# EAGLE design SevenSegmentBreakout (EAGLE 6.5.0)
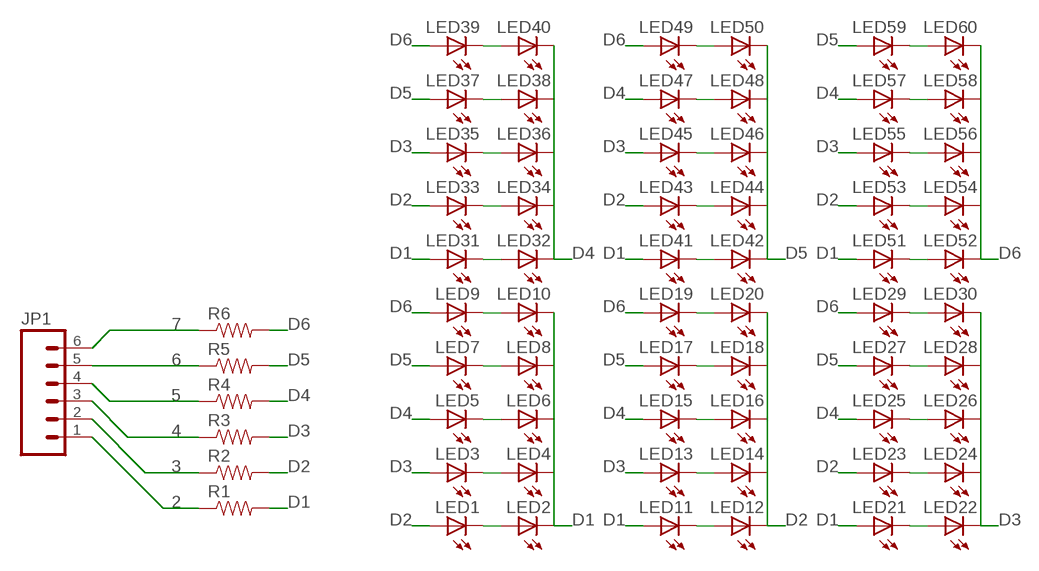
[diagram p0: schematic, sheet 1]

## Parts
JP1  M06SIP  [1X06]
LED1  LEDRECT  [RECTANGLE_LED]
LED2  LEDRECT  [RECTANGLE_LED]
LED3  LEDRECT  [RECTANGLE_LED]
LED4  LEDRECT  [RECTANGLE_LED]
LED5  LEDRECT  [RECTANGLE_LED]
LED6  LEDRECT  [RECTANGLE_LED]
LED7  LEDRECT  [RECTANGLE_LED]
LED8  LEDRECT  [RECTANGLE_LED]
LED9  LEDRECT  [RECTANGLE_LED]
LED10  LEDRECT  [RECTANGLE_LED]
LED11  LEDRECT  [RECTANGLE_LED]
LED12  LEDRECT  [RECTANGLE_LED]
LED13  LEDRECT  [RECTANGLE_LED]
LED14  LEDRECT  [RECTANGLE_LED]
LED15  LEDRECT  [RECTANGLE_LED]
LED16  LEDRECT  [RECTANGLE_LED]
LED17  LEDRECT  [RECTANGLE_LED]
LED18  LEDRECT  [RECTANGLE_LED]
LED19  LEDRECT  [RECTANGLE_LED]
LED20  LEDRECT  [RECTANGLE_LED]
LED21  LEDRECT  [RECTANGLE_LED]
LED22  LEDRECT  [RECTANGLE_LED]
LED23  LEDRECT  [RECTANGLE_LED]
LED24  LEDRECT  [RECTANGLE_LED]
LED25  LEDRECT  [RECTANGLE_LED]
LED26  LEDRECT  [RECTANGLE_LED]
LED27  LEDRECT  [RECTANGLE_LED]
LED28  LEDRECT  [RECTANGLE_LED]
LED29  LEDRECT  [RECTANGLE_LED]
LED30  LEDRECT  [RECTANGLE_LED]
LED31  LEDRECT  [RECTANGLE_LED]
LED32  LEDRECT  [RECTANGLE_LED]
LED33  LEDRECT  [RECTANGLE_LED]
LED34  LEDRECT  [RECTANGLE_LED]
LED35  LEDRECT  [RECTANGLE_LED]
LED36  LEDRECT  [RECTANGLE_LED]
LED37  LEDRECT  [RECTANGLE_LED]
LED38  LEDRECT  [RECTANGLE_LED]
LED39  LEDRECT  [RECTANGLE_LED]
LED40  LEDRECT  [RECTANGLE_LED]
LED41  LEDRECT  [RECTANGLE_LED]
LED42  LEDRECT  [RECTANGLE_LED]
LED43  LEDRECT  [RECTANGLE_LED]
LED44  LEDRECT  [RECTANGLE_LED]
LED45  LEDRECT  [RECTANGLE_LED]
LED46  LEDRECT  [RECTANGLE_LED]
LED47  LEDRECT  [RECTANGLE_LED]
LED48  LEDRECT  [RECTANGLE_LED]
LED49  LEDRECT  [RECTANGLE_LED]
LED50  LEDRECT  [RECTANGLE_LED]
LED51  LEDRECT  [RECTANGLE_LED]
LED52  LEDRECT  [RECTANGLE_LED]
LED53  LEDRECT  [RECTANGLE_LED]
LED54  LEDRECT  [RECTANGLE_LED]
LED55  LEDRECT  [RECTANGLE_LED]
LED56  LEDRECT  [RECTANGLE_LED]
LED57  LEDOVAL  [LED-OVAL]
LED58  LEDOVAL  [LED-OVAL]
LED59  LEDOVAL  [LED-OVAL]
LED60  LEDOVAL  [LED-OVAL]
R1  RESISTORAXIAL-0.3  [AXIAL-0.3]
R2  RESISTORAXIAL-0.3  [AXIAL-0.3]
R3  RESISTORAXIAL-0.3  [AXIAL-0.3]
R4  RESISTORAXIAL-0.3  [AXIAL-0.3]
R5  RESISTORAXIAL-0.3  [AXIAL-0.3]
R6  RESISTORAXIAL-0.3  [AXIAL-0.3]

## Nets
2: JP1.1 R1.P$1
3: JP1.2 R2.P$1
4: JP1.3 R3.P$1
5: JP1.4 R4.P$1
6: JP1.5 R5.P$1
7: JP1.6 R6.P$1
D1: LED2.C LED4.C LED6.C LED8.C LED10.C LED11.A LED21.A LED31.A LED41.A LED51.A R1.P$2
D2: LED1.A LED12.C LED14.C LED16.C LED18.C LED20.C LED23.A LED33.A LED43.A LED53.A R2.P$2
D3: LED3.A LED13.A LED22.C LED24.C LED26.C LED28.C LED30.C LED35.A LED45.A LED55.A R3.P$2
D4: LED5.A LED15.A LED25.A LED32.C LED34.C LED36.C LED38.C LED40.C LED47.A LED57.ANODE(A) R4.P$2
D5: LED7.A LED17.A LED27.A LED37.A LED42.C LED44.C LED46.C LED48.C LED50.C LED59.ANODE(A) R5.P$2
D6: LED9.A LED19.A LED29.A LED39.A LED49.A LED52.C LED54.C LED56.C LED58.CATHODE(C) LED60.CATHODE(C) R6.P$2
N$1: LED1.C LED2.A
N$2: LED3.C LED4.A
N$3: LED5.C LED6.A
N$4: LED7.C LED8.A
N$5: LED9.C LED10.A
N$6: LED11.C LED12.A
N$7: LED13.C LED14.A
N$8: LED15.C LED16.A
N$9: LED17.C LED18.A
N$10: LED19.C LED20.A
N$11: LED21.C LED22.A
N$12: LED23.C LED24.A
N$13: LED25.C LED26.A
N$14: LED27.C LED28.A
N$15: LED29.C LED30.A
N$16: LED31.C LED32.A
N$17: LED33.C LED34.A
N$18: LED35.C LED36.A
N$19: LED37.C LED38.A
N$20: LED39.C LED40.A
N$21: LED41.C LED42.A
N$22: LED43.C LED44.A
N$23: LED45.C LED46.A
N$24: LED47.C LED48.A
N$25: LED49.C LED50.A
N$26: LED51.C LED52.A
N$27: LED53.C LED54.A
N$28: LED55.C LED56.A
N$29: LED57.CATHODE(C) LED58.ANODE(A)
N$30: LED59.CATHODE(C) LED60.ANODE(A)

## Library data of the parts
JP1 = SparkFun-Connectors:M06: Header 6 Standard 6-pin 0.1" header. Use with straight break away headers (SKU : PRT-00116), right angle break away headers (PRT-00553), swiss pins (PRT-00743), machine pins (PRT-00117), and female headers (PRT-00115). Molex polarized connector foot print use with SKU : PRT-08094 with associated crimp pins and housings. NOTES ON THE VARIANTS LOCK and LOCK_LONGPADS... This footprint was designed to help hold the alignment of a through-hole component (i.e. 6-pin header) while soldering it into place. You may notice that each hole has been shifted either up or down by 0.005 of an inch from it's more standard position (which is a perfectly straight line). This slight alteration caused the pins (the squares in the middle) to touch the edges of the holes. Because they are alternating, it causes a "brace" to hold the component in place. 0.005 has proven to be the perfect amount of "off-center" position when using our standard breakaway headers. Although looks a little odd when you look at the bare footprint, once you have a header in there, the alteration is very hard to notice. Also,if you push a header all the way into place, it is covered up entirely on the bottom side. This idea of altering the position of holes to aid alignment will be further integrated into the Sparkfun Library for other footprints. It can help hold any component with 3 or more connection pins.
LED1-LED60 = barbary_enterprises:LED: LEDs Standard schematic elements and footprints for 5mm, 3mm, 1206, and 0603 sized LEDs. 5mm - Spark Fun Electronics SKU : COM-00529 (and others)
R1-R6 = SparkFun-Resistors:RESISTOR: Resistor Basic schematic elements and footprints for 0603, 1206, and PTH resistors.

## Board
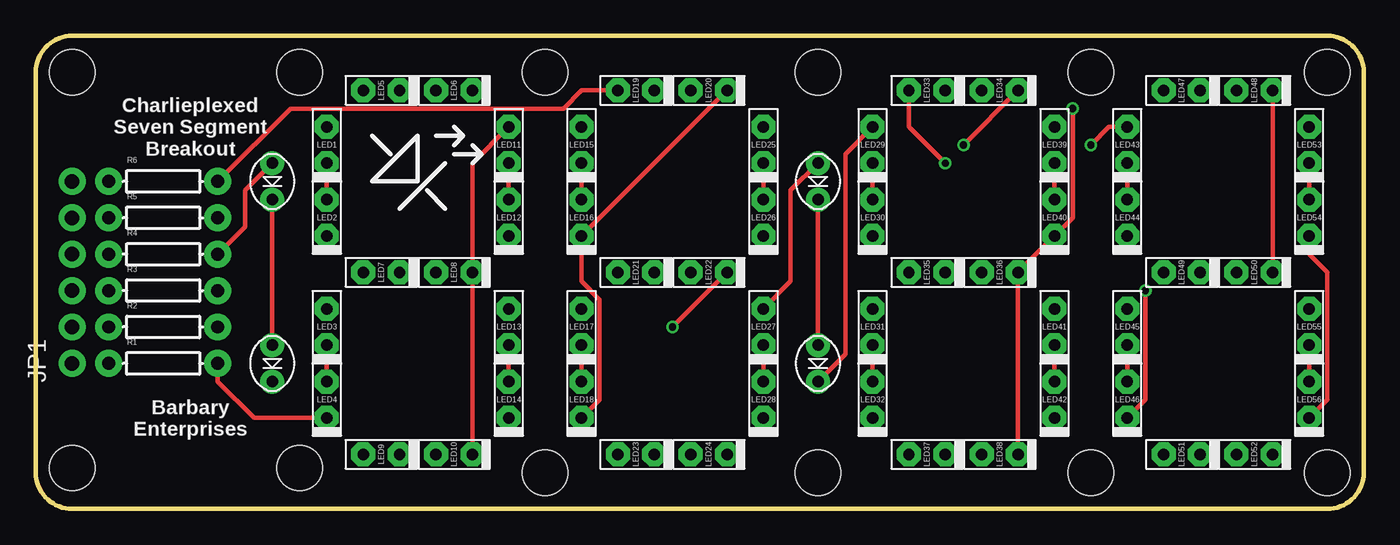
[diagram p1: board, top side]
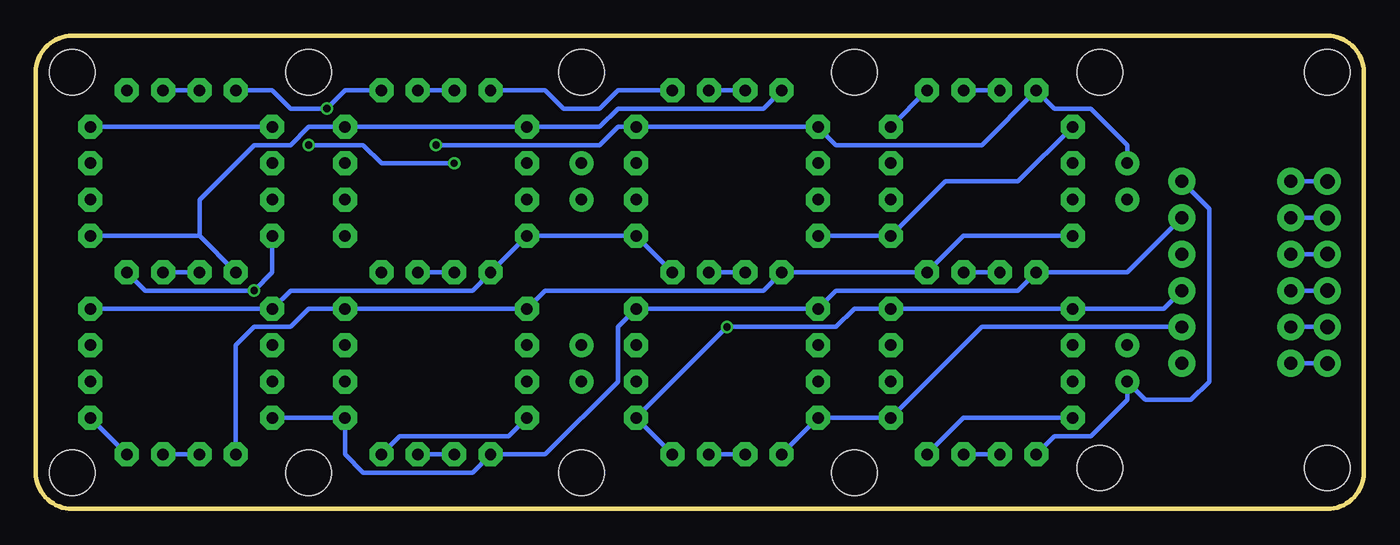
[diagram p2: board, bottom side, seen from below]

Size 92.71 x 33.02 mm. Coordinates in mm from the lower left corner, seen from the top.
Outline: 92.71,2.54 92.71,30.48 arc90 90.17,33.02 2.54,33.02 arc90 0,30.48 0,2.54 arc90 2.54,0 90.17,0 arc90 92.71,2.54
Copper layers (1*16): Top 0.0356mm / dielectric 1.5011mm / Bottom 0.0356mm
Design rules "LaenPCBOrder": minimum track width 6mil, minimum drill 13mil, track to track 6mil, track to pad 6mil, pad to pad 6mil, via to via 6mil, smd to smd 6mil, copper to edge 15mil, drill to drill 6mil, minimum pad ring 7mil, minimum via ring 7mil, stop-mask expansion 3mil, vias tented up to drill 0mil, thermal gap 10mil
Holes 3.17 mm at 90.17,30.48 18.41,30.48 18.41,2.86 90.17,2.54 2.54,30.48 2.54,2.86 35.56,30.48 73.66,30.48 73.66,2.54 35.56,2.54 54.61,2.54 54.61,30.48

### Footprints (pad centres in the part's own frame; a part is rotated, then mirrored left to right if it is on the bottom)
1X06 = drill 1.016 pad 1.88: 1 0,0; 2 2.54,0; 3 5.08,0; 4 7.62,0; 5 10.16,0; 6 12.7,0
RECTANGLE_LED = drill 0.8 pad 1.676 octagon: A 0,1.27; C 0,-1.27
LED-OVAL = drill 0.8 pad 1.676: ANODE 1.27,0; CATHODE -1.27,0
AXIAL-0.3 = drill 0.9 pad 1.88: P$1 -3.81,0; P$2 3.81,0

### Placement (x,y rotation side)
JP1  2.54,10.16 90 top
LED1  20.32,25.4 0 top
LED2  20.32,20.32 0 top
LED3  20.32,12.7 0 top
LED4  20.32,7.62 0 top
LED5  24.13,29.21 90 top
LED6  29.21,29.21 90 top
LED7  24.13,16.51 90 top
LED8  29.21,16.51 90 top
LED9  24.13,3.81 90 top
LED10  29.21,3.81 90 top
LED11  33.02,25.4 0 top
LED12  33.02,20.32 0 top
LED13  33.02,12.7 0 top
LED14  33.02,7.62 0 top
LED15  38.1,25.4 0 top
LED16  38.1,20.32 0 top
LED17  38.1,12.7 0 top
LED18  38.1,7.62 0 top
LED19  41.91,29.21 90 top
LED20  46.99,29.21 90 top
LED21  41.91,16.51 90 top
LED22  46.99,16.51 90 top
LED23  41.91,3.81 90 top
LED24  46.99,3.81 90 top
LED25  50.8,25.4 0 top
LED26  50.8,20.32 0 top
LED27  50.8,12.7 0 top
LED28  50.8,7.62 0 top
LED29  58.42,25.4 0 top
LED30  58.42,20.32 0 top
LED31  58.42,12.7 0 top
LED32  58.42,7.62 0 top
LED33  62.23,29.21 90 top
LED34  67.31,29.21 90 top
LED35  62.23,16.51 90 top
LED36  67.31,16.51 90 top
LED37  62.23,3.81 90 top
LED38  67.31,3.81 90 top
LED39  71.12,25.4 0 top
LED40  71.12,20.32 0 top
LED41  71.12,12.7 0 top
LED42  71.12,7.62 0 top
LED43  76.2,25.4 0 top
LED44  76.2,20.32 0 top
LED45  76.2,12.7 0 top
LED46  76.2,7.62 0 top
LED47  80.01,29.21 90 top
LED48  85.09,29.21 90 top
LED49  80.01,16.51 90 top
LED50  85.09,16.51 90 top
LED51  80.01,3.81 90 top
LED52  85.09,3.81 90 top
LED53  88.9,25.4 0 top
LED54  88.9,20.32 0 top
LED55  88.9,12.7 0 top
LED56  88.9,7.62 0 top
LED57  16.51,22.86 90 top
LED58  16.51,10.16 90 top
LED59  54.61,22.86 90 top
LED60  54.61,10.16 90 top
R1  8.89,10.16 0 top
R2  8.89,12.7 0 top
R3  8.89,15.24 0 top
R4  8.89,17.78 0 top
R5  8.89,20.32 0 top
R6  8.89,22.86 0 top

### Tracks (layer width: path | path; a pad name or v marks a point on that pad's centre or on a via)
2
  Bottom 0.305: JP1.1 R1.P$1
3
  Bottom 0.305: JP1.2 R2.P$1
4
  Bottom 0.305: JP1.3 R3.P$1
5
  Bottom 0.305: JP1.4 R4.P$1
6
  Bottom 0.305: JP1.5 R5.P$1
7
  Bottom 0.305: JP1.6 R6.P$1
D1
  Top 0.305: LED11.A 30.48,24.13 LED8.C LED10.C | LED4.C 15.24,6.35 12.7,8.89 R1.P$2
  Bottom 0.305: LED10.C 27.94,6.35 LED4.C | LED2.C 27.94,19.05 LED8.C LED21.A 41.91,15.24 57.15,15.24 LED31.A LED41.A 73.66,13.97 74.93,12.7 77.47,12.7 78.74,11.43 LED51.A | LED6.C LED11.A
D2  (via drill 0.51)
  Top 0.305: LED33.A 60.96,26.67 v63.5,24.13 | v73.66,25.4 74.93,26.67 LED43.A | LED20.C LED16.C 38.1,15.88 39.37,14.61 39.37,7.62 LED18.C
  Bottom 0.305: LED20.C 52.07,29.21 53.34,27.94 55.88,27.94 57.15,29.21 LED33.A | LED23.A LED18.C LED14.C 26.67,12.7 R2.P$2 | LED43.A LED53.A | LED1.A 24.13,22.86 29.21,22.86 LED12.C LED16.C | v63.5,24.13 68.58,24.13 69.85,25.4 v73.66,25.4
D3  (via drill 0.51)
  Top 0.305: v44.45,12.7 LED22.C
  Bottom 0.305: LED24.C LED28.C v44.45,12.7 36.83,12.7 35.56,13.97 LED13.A LED3.A 13.97,13.97 R3.P$2 | LED55.A LED45.A 74.93,15.24 62.23,15.24 LED35.A LED30.C LED26.C LED22.C
D4  (via drill 0.51)
  Top 0.305: v64.77,25.4 LED34.C | v72.39,27.94 72.39,20.32 LED40.C LED36.C LED38.C | R4.P$2 14.61,19.68 14.61,22.23 LED57.ANODE
  Bottom 0.305: LED34.C 71.12,29.21 v72.39,27.94 74.93,27.94 76.2,29.21 LED47.A | LED57.ANODE 16.51,25.4 19.05,27.94 21.59,27.94 LED5.A 26.67,25.4 36.83,25.4 LED15.A LED25.A 52.07,26.67 53.34,25.4 v64.77,25.4 | LED38.C 67.31,5.08 59.69,5.08 LED32.C
D5  (via drill 0.51)
  Top 0.305: LED50.C LED48.C | LED46.C 77.47,7.62 v77.47,15.24 | LED27.A 52.7,15.88 52.7,22.23 LED59.ANODE
  Bottom 0.305: LED46.C LED42.C 71.12,3.81 69.85,2.54 62.23,2.54 LED37.A 57.15,3.81 52.07,8.89 52.07,12.7 LED27.A LED17.A 36.83,15.24 24.13,15.24 LED7.A 16.51,16.51 R5.P$2 | LED50.C 85.09,15.24 v77.47,15.24 76.2,16.51 LED44.C
D6
  Top 0.305: LED54.C 88.9,17.78 90.17,16.51 90.17,7.62 LED56.C | LED60.CATHODE 56.52,10.79 56.52,24.77 LED29.A | LED19.A 38.1,29.21 36.83,27.94 17.78,27.94 R6.P$2
  Bottom 0.305: LED52.C LED56.C | LED9.A 21.59,5.08 19.05,5.08 16.51,7.62 LED58.CATHODE 15.24,7.62 12.06,7.62 10.79,8.89 10.79,20.95 R6.P$2 | LED19.A 41.91,27.94 52.07,27.94 53.34,26.67 LED29.A LED39.A 73.66,26.67 74.93,25.4 77.47,25.4 81.28,21.59 81.28,19.05 | LED54.C 81.28,19.05 | 81.28,19.05 LED49.A
N$1
  Top 0.305: LED1.C LED2.A
N$2
  Top 0.305: LED3.C LED4.A
N$3
  Bottom 0.305: LED5.C LED6.A
N$4
  Bottom 0.305: LED8.A LED7.C
N$5
  Bottom 0.305: LED9.C LED10.A
N$6
  Top 0.305: LED11.C LED12.A
N$7
  Top 0.305: LED13.C LED14.A
N$8
  Top 0.305: LED15.C LED16.A
N$9
  Top 0.305: LED17.C LED18.A
N$10
  Bottom 0.305: LED19.C LED20.A
N$11
  Bottom 0.305: LED21.C LED22.A
N$12
  Bottom 0.305: LED23.C LED24.A
N$13
  Top 0.305: LED25.C LED26.A
N$14
  Top 0.305: LED27.C LED28.A
N$15
  Top 0.305: LED29.C LED30.A
N$16
  Top 0.305: LED31.C LED32.A
N$17
  Bottom 0.305: LED33.C LED34.A
N$18
  Bottom 0.305: LED36.A LED35.C
N$19
  Bottom 0.305: LED38.A LED37.C
N$20
  Top 0.305: LED39.C LED40.A
N$21
  Top 0.305: LED41.C LED42.A
N$22
  Top 0.305: LED43.C LED44.A
N$23
  Top 0.305: LED45.C LED46.A
N$24
  Bottom 0.305: LED47.C LED48.A
N$25
  Bottom 0.305: LED49.C LED50.A
N$26
  Bottom 0.305: LED52.A LED51.C
N$27
  Top 0.305: LED53.C LED54.A
N$28
  Top 0.305: LED55.C LED56.A
N$29
  Top 0.305: LED57.CATHODE LED58.ANODE
N$30
  Top 0.305: LED59.CATHODE LED60.ANODE

### Text on the board
tPlace: Charlieplexed / Seven Segment / Breakout | Barbary / Enterprises